# EAGLE design Power Distribution (EAGLE 9.6.2)
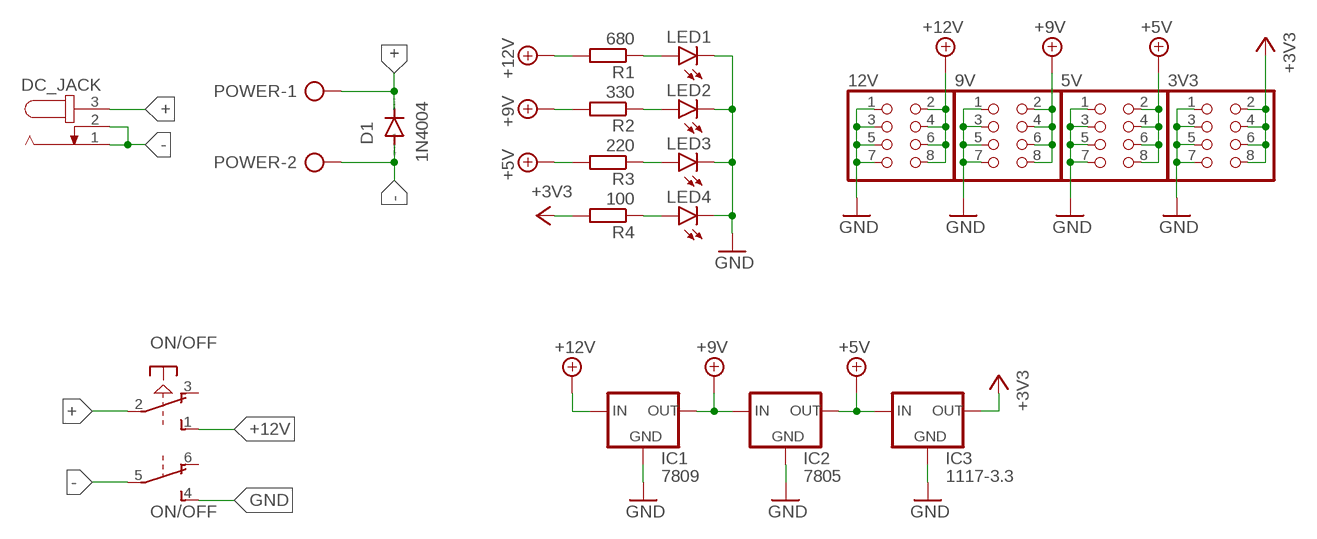
[diagram p0: schematic, sheet 1]

## Parts
3V3  PINHD-2X4  [2X04]
5V  PINHD-2X4  [2X04]
9V  PINHD-2X4  [2X04]
12V  PINHD-2X4  [2X04]
D1  1N4004  [DO41-10]
DC_JACK  JACK-PLUG0  [SPC4077]
IC1  7809  78XXS  [78XXS]
IC2  7805  78XXS  [78XXS]
IC3  1117-3.3  78XXS  [78XXS]
LED1  LED5MM  [LED5MM]
LED2  LED5MM  [LED5MM]
LED3  LED5MM  [LED5MM]
LED4  LED5MM  [LED5MM]
ON/OFF  PVA2R  [PVA2R]
POWER  AK500/2-H  [AK500/2-H]
R1  680  R-EU_0207/10  [0207/10]
R2  330  R-EU_0207/10  [0207/10]
R3  220  R-EU_0207/10  [0207/10]
R4  100  R-EU_0207/10  [0207/10]

## Nets
+: D1.C DC_JACK.3 ON/OFF.2(1:P) POWER.1
+3V3: 3V3.2 3V3.4 3V3.6 3V3.8 IC3.OUT R4.2
+5V: 5V.2 5V.4 5V.6 5V.8 IC2.OUT IC3.IN R3.2
+9V: 9V.2 9V.4 9V.6 9V.8 IC1.OUT IC2.IN R2.2
+12V: 12V.2 12V.4 12V.6 12V.8 IC1.IN ON/OFF.1(1:S) R1.2
-: D1.A DC_JACK.1 DC_JACK.2 ON/OFF.5(2:P) POWER.2
GND: 3V3.1 3V3.3 3V3.5 3V3.7 5V.1 5V.3 5V.5 5V.7 9V.1 9V.3 9V.5 9V.7 12V.1 12V.3 12V.5 12V.7 IC1.GND IC2.GND IC3.GND LED1.K(C) LED2.K(C) LED3.K(C) LED4.K(C) ON/OFF.4(2:S)
N$3: LED1.A R1.1
N$4: LED2.A R2.1
N$5: LED3.A R3.1
N$6: LED4.A R4.1
Unconnected: ON/OFF.3(1:O) ON/OFF.6(2:O)

## Library data of the parts
3V3 5V 9V 12V = Connector:PINHD-2X4: PIN HEADER; CATEGORY: CONNECTOR; SUB-CATEGORY: PIN-HEADER
D1 = diode:1N4004: DIODE general purpose rectifier, 1 A
DC_JACK = con-jack:JACK-PLUG: DC POWER JACK Power Jack, DC, Right Angle, Through Hole, Rated 5A at 16VDC, PC Terminals Distributor: Farnell (www.Farnell.de) Drawing: 84N1161.pdf / 84N1162.pdf Manufacturer: SPC Technology (www.spctechnology.com) Type: SPC4077 / SPC 4078; OC_FARNELL: unknown; OC_NEWARK: unknown
IC1-IC3 = v-reg:78XXS: VOLTAGE REGULATOR
LED1-LED4 = led:LED: LED OSRAM: - CHIPLED LG R971, LG N971, LY N971, LG Q971, LY Q971, LO R971, LY R971 LH N974, LH R974 LS Q976, LO Q976, LY Q976 LO Q996 - Hyper CHIPLED LW Q18S LB Q993, LB Q99A, LB R99A - SideLED LS A670, LO A670, LY A670, LG A670, LP A670 LB A673, LV A673, LT A673, LW A673 LH A674 LY A675 LS A676, LA A676, LO A676, LY A676, LW A676 LS A679, LY A679, LG A679 - Hyper Micro SIDELED® LS Y876, LA Y876, LO Y876, LY Y876 LT Y87S - SmartLED LW L88C, LW L88S LB L89C, LB L89S, LG L890 LS L89K, LO L89K, LY L89K LS L896, LA L896, LO L896, LY L896 - TOPLED LS T670, LO T670, LY T670, LG T670, LP T670 LSG T670, LSP T670, LSY T670, LOP T670, LYG T670 LG T671, LOG T671, LSG T671 LB T673, LV T673, LT T673, LW T673 LH T674 LS T676, LA T676, LO T676, LY T676, LB T676, LH T676, LSB T676, LW T676 LB T67C, LV T67C, LT T67C, LS T67K, LO T67K, LY T67K, LW E67C LS E67B, LA E67B, LO E67B, LY E67B, LB E67C, LV E67C, LT E67C LW T67C LS T679, LY T679, LG T679 LS T770, LO T770, LY T770, LG T770, LP T770 LB T773, LV T773, LT T773, LW T773 LH T774 LS E675, LA E675, LY E675, LS T675 LS T776, LA T776, LO T776, LY T776, LB T776 LHGB T686 LT T68C, LB T68C - Hyper Mini TOPLED® LB M676 - Mini TOPLED Santana® LG M470 LS M47K, LO M47K, LY M47K Source: http://www.osram.convergy.de LUXEON: - LUMILED® LXK2-PW12-R00, LXK2-PW12-S00, LXK2-PW14-U00, LXK2-PW14-V00 LXK2-PM12-R00, LXK2-PM12-S00, LXK2-PM14-U00 LXK2-PE12-Q00, LXK2-PE12-R00, LXK2-PE12-S00, LXK2-PE14-T00, LXK2-PE14-U00 LXK2-PB12-K00, LXK2-PB12-L00, LXK2-PB12-M00, LXK2-PB14-N00, LXK2-PB14-P00, LXK2-PB14-Q00 LXK2-PR12-L00, LXK2-PR12-M00, LXK2-PR14-Q00, LXK2-PR14-R00 LXK2-PD12-Q00, LXK2-PD12-R00, LXK2-PD12-S00 LXK2-PH12-R00, LXK2-PH12-S00 LXK2-PL12-P00, LXK2-PL12-Q00, LXK2-PL12-R00 Source: www.luxeon.com KINGBRIGHT: KA-3528ASYC Source: www.kingbright.com
ON/OFF = switch-misc:PVA2R: ITT SWITCH
POWER = con-ptr500:AK500/2-H: CONNECTOR Aug. 2004 / PTR Meßtechnik: Die Bezeichnung der Serie AK505 wurde geändert. Es handelt sich hierbei um AK500 in horizontaler Ausführung.; OC_FARNELL: unknown; OC_NEWARK: unknown
R1-R4 = rcl:R-EU_: RESISTOR, European symbol; SPICEPREFIX: R

## Board
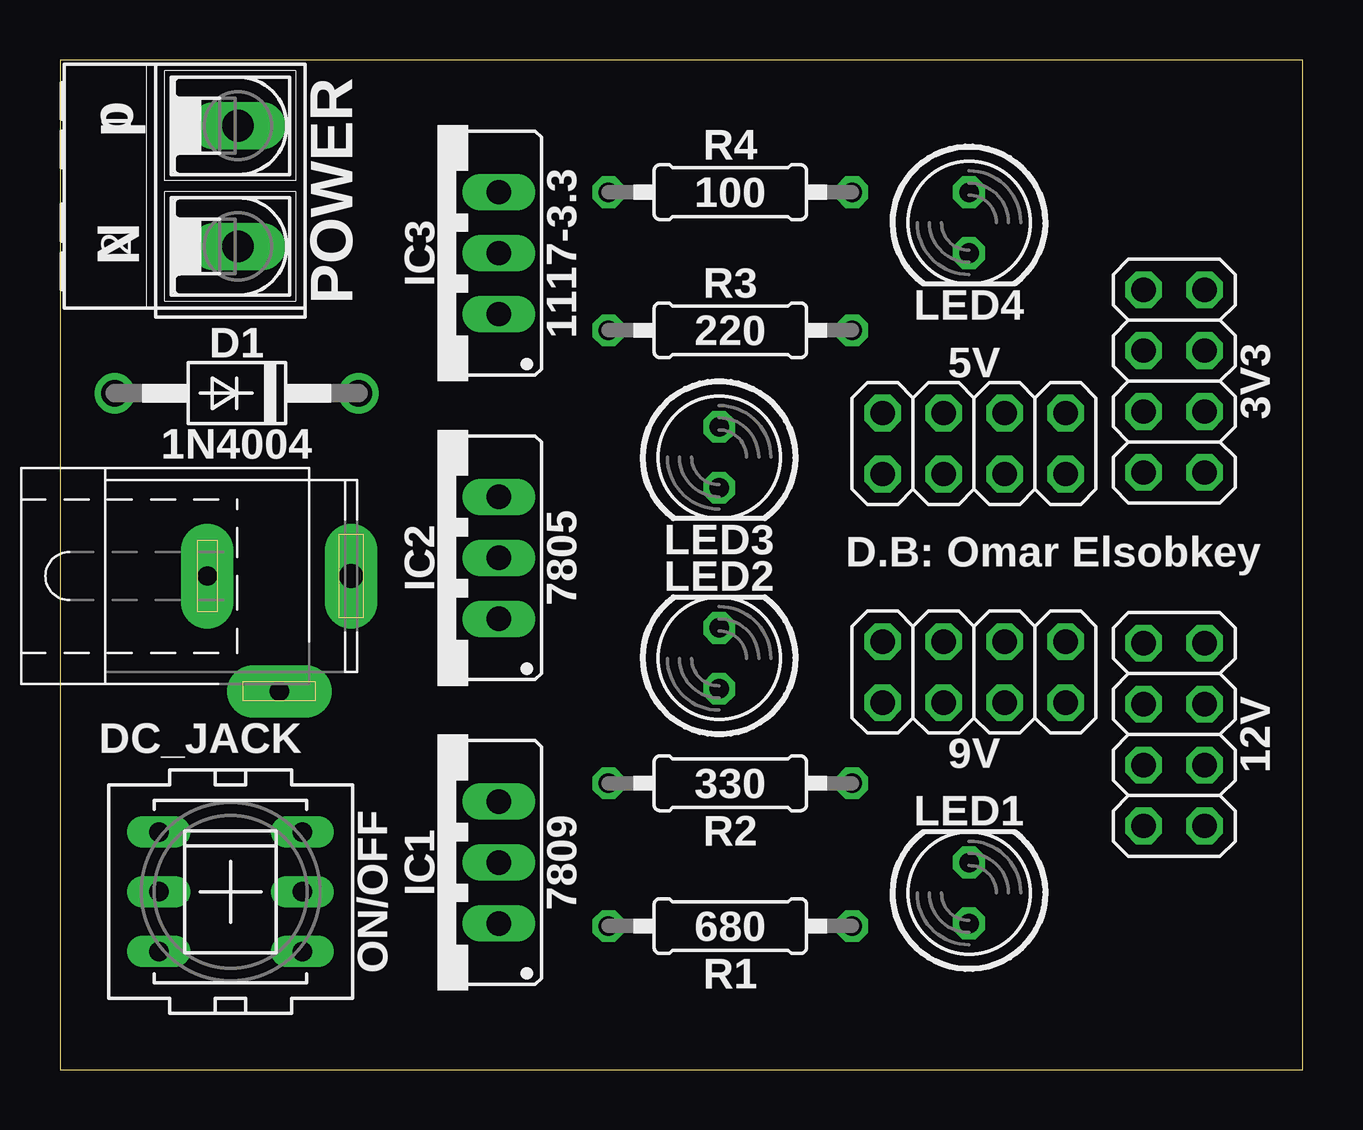
[diagram p1: board, top side]
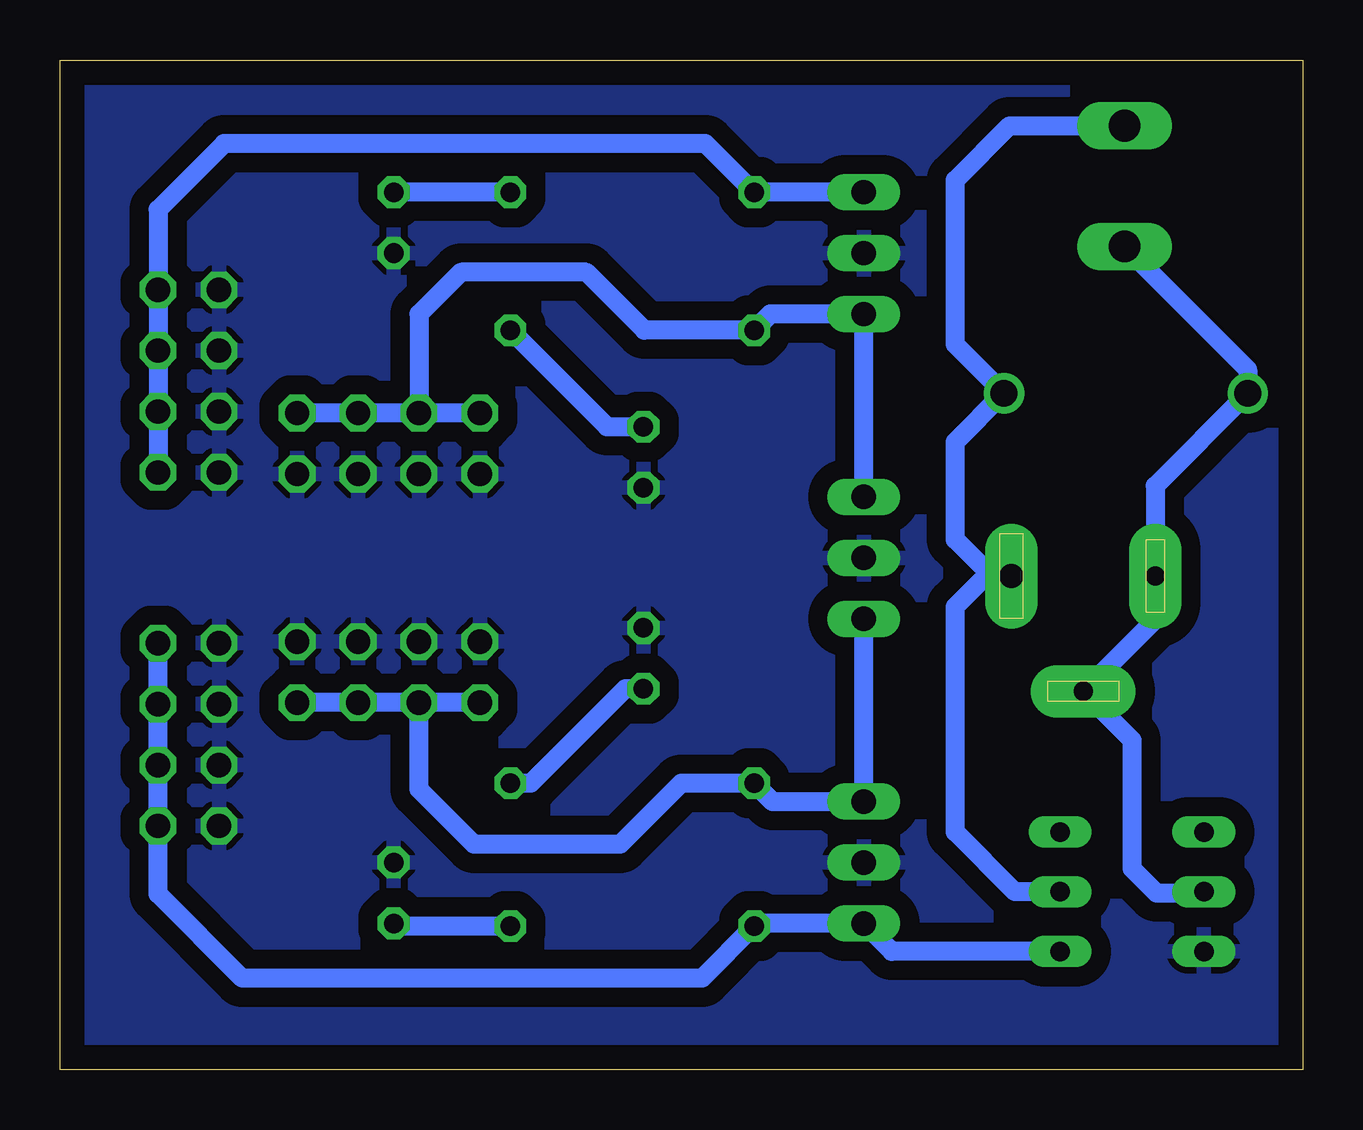
[diagram p2: board, bottom side, seen from below]

Size 51.8 x 42.09 mm. Coordinates in mm from the lower left corner, seen from the top.
Outline: 0,0 51.8,0 51.8,42.09 0,42.09 0,0
Copper layers (1*16): Top 0.035mm / dielectric 1.5mm / Bottom 0.035mm
Design rules "default *": minimum track width 0.8mm, minimum drill 0.7mm, track to track 0.6mm, track to pad 0.6mm, pad to pad 0.6mm, via to via 0.6mm, smd to smd 6mil, copper to edge 40mil, drill to drill 6mil, minimum pad ring 10mil, minimum via ring 8mil, stop-mask expansion 4mil, vias tented up to drill 0mil, thermal gap 10mil

### Footprints (pad centres in the part's own frame; a part is rotated, then mirrored left to right if it is on the bottom)
2X04 = drill 1.016 octagon: 1 -3.81,-1.27; 2 -3.81,1.27; 3 -1.27,-1.27; 4 -1.27,1.27; 5 1.27,-1.27; 6 1.27,1.27; 7 3.81,-1.27; 8 3.81,1.27
DO41-10 = drill 1.118: A 5.08,0; C -5.08,0
SPC4077 = drill 0.8 pad 2.184 long: 1 -3,0; 2 0,-4.8 | drill 1 pad 2.184 long: 3 3,0
78XXS = drill 1.016 long: GND 0,-2.54; IN -2.54,-2.54; OUT 2.54,-2.54
LED5MM = drill 0.813 octagon: A -1.27,0; K 1.27,0
PVA2R = drill 0.813 long: 1 -2.997,2.489; 2 -2.997,0; 3 -2.997,-2.489; 4 2.997,2.489; 5 2.997,0; 6 2.997,-2.489
AK500/2-H = drill 1.321 long: 1 -2.515,0; 2 2.515,0
0207/10 = drill 0.813 octagon: 1 -5.08,0; 2 5.08,0

### Placement (x,y rotation side)
3V3  46.44,28.7 270 top
5V  38.1,26.1 0 top
9V  38.1,16.57 180 top
12V  46.44,13.97 270 top
D1  7.37,28.19 180 top
DC_JACK  9.14,20.57 0 top
IC1  15.75,8.64 90 top
IC2  15.75,21.34 90 top
IC3  15.75,34.04 90 top
LED1  37.89,7.37 90 top
LED2  27.47,17.14 90 top
LED3  27.47,25.53 270 top
LED4  37.89,35.31 270 top
ON/OFF  7.11,7.42 180 top
POWER  7.42,36.83 270 top
R1  27.94,5.98 180 top
R2  27.94,11.94 180 top
R3  27.94,30.82 180 top
R4  27.94,36.58 180 top

### Tracks (layer width: path | path; a pad name or v marks a point on that pad's centre or on a via)
+
  Bottom 0.8: ON/OFF.2 11.99,7.42 14.48,9.91 14.48,19.3 13.21,20.57 DC_JACK.3 12.95,20.57 14.48,22.1 14.48,26.16 D1.C 14.48,30.23 14.48,37.08 12.22,39.34 POWER.1
+3V3
  Bottom 0.8: IC3.OUT R4.2 24.89,38.61 44.96,38.61 47.71,35.86 3V3.2 3V3.4 3V3.6 3V3.8
+5V
  Bottom 0.8: IC2.OUT IC3.IN 22.18,31.5 R3.2 27.43,30.82 29.85,33.24 35.09,33.24 36.83,31.5 5V.4 | 5V.2 5V.4 | 5V.4 5V.6 5V.8
+9V
  Bottom 0.8: IC2.IN IC1.OUT 22.1,11.18 R2.2 25.91,11.94 28.45,9.4 34.54,9.4 36.83,11.68 9V.6 | 9V.8 9V.6 | 9V.6 9V.4 9V.2
+12V
  Bottom 0.8: ON/OFF.1 17.12,4.93 IC1.IN 22.75,6.1 R1.2 25.03,3.81 44.2,3.81 47.71,7.32 12V.8 12V.6 12V.4 12V.2
-
  Bottom 0.8: ON/OFF.5 4.17,7.37 6.1,7.37 7.11,8.38 7.11,13.74 DC_JACK.2 6.14,18.77 DC_JACK.1 6.14,24.34 D1.A 2.29,29.18 POWER.2
GND
  pour Bottom (isolate 0.8): 0,42.16 52.07,42.16 52.07,0.25 0,0.25
N$3
  Bottom 0.8: LED1.A 37.78,5.98 R1.1
N$4
  Bottom 0.8: LED2.A 28.24,15.88 32.17,11.94 R2.1
N$5
  Bottom 0.8: R3.1 29,26.8 LED3.A
N$6
  Bottom 0.8: R4.1 LED4.A | LED4.A

### Text on the board
tPlace: p | N
tNames: D.B: Omar Elsobkey